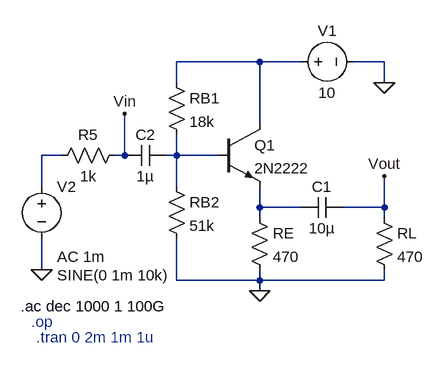
[diagram p0: schematic bjt_cc.asc]
bjt_cc.asc, the LTspice schematic file:
Version 4.1
SHEET 1 880 680
WIRE 224 32 96 32
WIRE 288 32 224 32
WIRE 416 32 368 32
WIRE 96 64 96 32
WIRE 416 64 416 32
WIRE 224 128 224 32
WIRE -80 176 -112 176
WIRE 16 176 16 112
WIRE 16 176 0 176
WIRE 96 176 96 144
WIRE 96 176 80 176
WIRE 160 176 96 176
WIRE -112 224 -112 176
WIRE 96 224 96 176
WIRE 224 256 224 224
WIRE 288 256 224 256
WIRE 416 256 416 208
WIRE 416 256 352 256
WIRE 224 272 224 256
WIRE 416 272 416 256
WIRE -112 352 -112 304
WIRE 96 368 96 304
WIRE 224 368 224 352
WIRE 224 368 96 368
WIRE 416 368 416 352
WIRE 416 368 224 368
WIRE 224 384 224 368
FLAG 416 64 0
FLAG 224 384 0
FLAG -112 352 0
FLAG 416 208 Vout
FLAG 16 112 Vin
SYMBOL npn 160 128 R0
SYMATTR InstName Q1
SYMATTR Value 2N2222
SYMBOL res 80 48 R0
SYMATTR InstName RB1
SYMATTR Value 18k
SYMBOL voltage 272 32 R270
WINDOW 0 32 56 VTop 2
WINDOW 3 -32 56 VBottom 2
WINDOW 123 0 0 Left 0
WINDOW 39 0 0 Left 0
SYMATTR InstName V1
SYMATTR Value 10
SYMBOL res 80 208 R0
SYMATTR InstName RB2
SYMATTR Value 51k
SYMBOL res 208 256 R0
SYMATTR InstName RE
SYMATTR Value 470
SYMBOL cap 352 240 R90
WINDOW 0 0 32 VBottom 2
WINDOW 3 32 32 VTop 2
SYMATTR InstName C1
SYMATTR Value 10µ
SYMBOL res 400 256 R0
SYMATTR InstName RL
SYMATTR Value 470
SYMBOL cap 80 160 R90
WINDOW 0 0 32 VBottom 2
WINDOW 3 32 32 VTop 2
SYMATTR InstName C2
SYMATTR Value 1µ
SYMBOL res 16 160 R90
WINDOW 0 0 56 VBottom 2
WINDOW 3 32 56 VTop 2
SYMATTR InstName R5
SYMATTR Value 1k
SYMBOL voltage -112 208 R0
WINDOW 3 24 152 Left 2
WINDOW 123 24 124 Left 2
WINDOW 39 0 0 Left 0
SYMATTR Value SINE(0 1m 10k)
SYMATTR Value2 AC 1m
SYMATTR InstName V2
TEXT -144 408 Left 2 !.ac dec 1000 1 100G
TEXT -128 432 Left 2 ;.op
TEXT -120 456 Left 2 ;.tran 0 2m 1m 1u

The netlist it stands for:
* bjt_cc.asc
Q1 N001 N003 N004 0 2N2222
RB1 N001 N003 18k
V1 N001 0 10
RB2 N003 0 51k
RE N004 0 470
C1 Vout N004 10µ
RL Vout 0 470
C2 N003 Vin 1µ
R5 Vin N002 1k
V2 N002 0 SINE(0 1m 10k) AC 1m
.model NPN NPN
.model PNP PNP
.lib standard.bjt
.ac dec 1000 1 100G
* .op
* .tran 0 2m 1m 1u
.backanno
.end